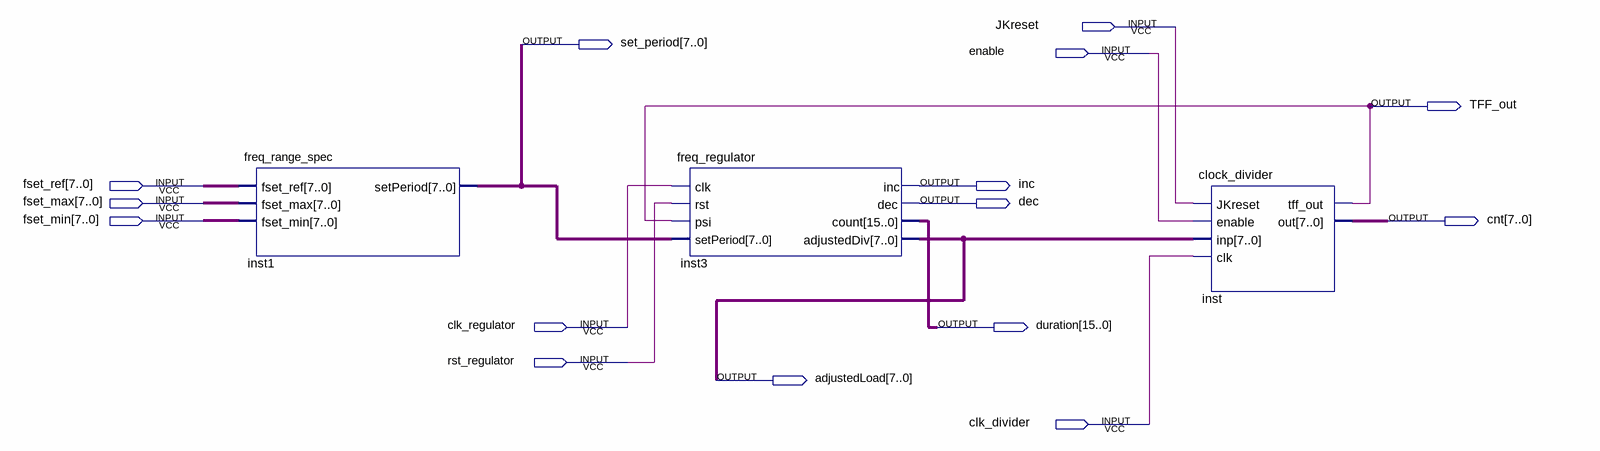
[diagram p0: schematic sheet]
// Quartus schematic exp2.bdf as structural Verilog: 3 symbols, 15 pins
module exp2 (
  input  JKreset,
  input  enable,
  input  [7:0] fset_ref,
  input  [7:0] fset_max,
  input  [7:0] fset_min,
  input  clk_regulator,
  input  rst_regulator,
  input  clk_divider,
  output [7:0] set_period,
  output TFF_out,
  output inc,
  output dec,
  output [7:0] cnt,
  output [15:0] duration,
  output [7:0] adjustedLoad
);

  freq_range_spec inst1 (.fset_ref(fset_ref), .fset_max(fset_max), .fset_min(fset_min), .setPeriod(set_period));
  freq_regulator inst3 (
    .clk(clk_regulator), .rst(rst_regulator), .psi(TFF_out), .setPeriod(set_period), .inc(inc), .dec(dec),
    .count(duration), .adjustedDiv(adjustedLoad));
  clock_divider inst (
    .JKreset(JKreset), .enable(enable), .inp(adjustedLoad), .clk(clk_divider), .tff_out(TFF_out), .out(cnt));
endmodule
